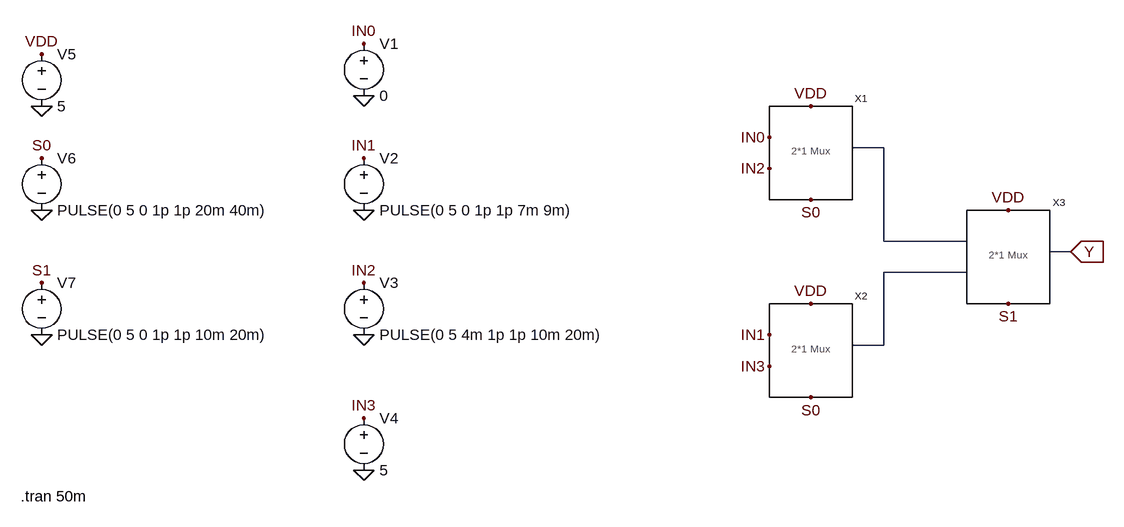
[diagram p0: schematic CASCADED_MUX_TG.asc]
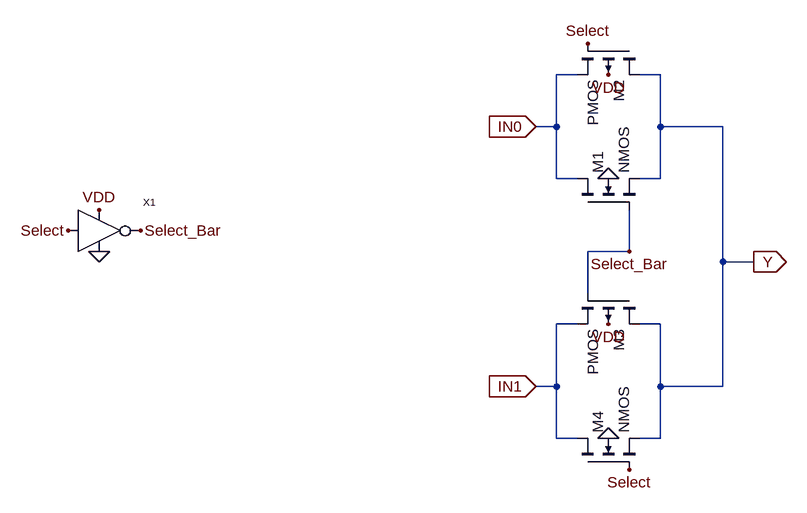
[diagram p1: sub-circuit mux_tg.asc]
CASCADED_MUX_TG.asc, the LTspice schematic file:
Version 4
SHEET 1 1292 680
WIRE 880 -128 832 -128
WIRE 880 16 880 -128
WIRE 1008 16 880 16
WIRE 1168 32 1136 32
WIRE 1008 64 880 64
WIRE 880 176 880 64
WIRE 880 176 832 176
FLAG 80 -288 IN0
FLAG 80 -112 IN1
FLAG 80 80 IN2
FLAG 80 288 IN3
FLAG 80 -208 0
FLAG 80 -32 0
FLAG 80 160 0
FLAG 80 368 0
FLAG -416 160 0
FLAG -416 -32 0
FLAG -416 -192 0
FLAG -416 -272 VDD
FLAG -416 -112 S0
FLAG -416 80 S1
FLAG 768 -192 VDD
FLAG 768 112 VDD
FLAG 1072 -32 VDD
FLAG 704 -144 IN0
FLAG 704 160 IN1
FLAG 704 -96 IN2
FLAG 704 208 IN3
FLAG 768 -48 S0
FLAG 768 256 S0
FLAG 1072 112 S1
FLAG 1168 32 Y
IOPIN 1168 32 In
SYMBOL voltage 80 -304 R0
WINDOW 123 0 0 Left 0
WINDOW 39 0 0 Left 0
SYMATTR InstName V1
SYMATTR Value 0
SYMBOL voltage 80 -128 R0
WINDOW 123 0 0 Left 0
WINDOW 39 0 0 Left 0
SYMATTR InstName V2
SYMATTR Value PULSE(0 5 0 1p 1p 7m 9m)
SYMBOL voltage 80 64 R0
WINDOW 123 0 0 Left 0
WINDOW 39 0 0 Left 0
SYMATTR InstName V3
SYMATTR Value PULSE(0 5 4m 1p 1p 10m 20m)
SYMBOL voltage 80 272 R0
WINDOW 123 0 0 Left 0
WINDOW 39 0 0 Left 0
SYMATTR InstName V4
SYMATTR Value 5
SYMBOL voltage -416 -288 R0
WINDOW 123 0 0 Left 0
WINDOW 39 0 0 Left 0
SYMATTR InstName V5
SYMATTR Value 5
SYMBOL voltage -416 -128 R0
WINDOW 123 0 0 Left 0
WINDOW 39 0 0 Left 0
SYMATTR InstName V6
SYMATTR Value PULSE(0 5 0 1p 1p 20m 40m)
SYMBOL voltage -416 64 R0
WINDOW 123 0 0 Left 0
WINDOW 39 0 0 Left 0
SYMATTR InstName V7
SYMATTR Value PULSE(0 5 0 1p 1p 10m 20m)
SYMBOL MUX_TG 704 -48 R0
SYMATTR InstName X1
SYMBOL MUX_TG 704 256 R0
SYMATTR InstName X2
SYMBOL MUX_TG 1008 112 R0
SYMATTR InstName X3
TEXT -448 408 Left 2 !.tran 50m

mux_tg.asc, the sub-circuit schematic file:
Version 4
SHEET 1 908 680
WIRE 560 -224 528 -224
WIRE 688 -224 656 -224
WIRE 528 -144 528 -224
WIRE 528 -144 496 -144
WIRE 688 -144 688 -224
WIRE 784 -144 688 -144
WIRE 528 -64 528 -144
WIRE 560 -64 528 -64
WIRE 688 -64 688 -144
WIRE 688 -64 656 -64
WIRE 640 48 640 -16
WIRE 640 48 576 48
WIRE 784 64 784 -144
WIRE 832 64 784 64
WIRE 576 112 576 48
WIRE 560 160 528 160
WIRE 688 160 656 160
WIRE 528 256 528 160
WIRE 528 256 496 256
WIRE 688 256 688 160
WIRE 784 256 784 64
WIRE 784 256 688 256
WIRE 528 336 528 256
WIRE 560 336 528 336
WIRE 688 336 688 256
WIRE 688 336 656 336
FLAG 640 48 Select_Bar
FLAG 576 -272 Select
FLAG 640 384 Select
FLAG 608 -64 0
FLAG 608 336 0
FLAG 608 -224 VDD
FLAG 608 160 VDD
FLAG 832 64 Y
IOPIN 832 64 Out
FLAG 496 256 IN1
IOPIN 496 256 In
FLAG 496 -144 IN0
IOPIN 496 -144 In
FLAG -224 16 Select
FLAG -112 16 Select_Bar
FLAG -176 -16 VDD
FLAG -176 48 0
SYMBOL nmos4 560 -16 R270
SYMATTR InstName M1
SYMBOL pmos4 656 -272 R90
SYMATTR InstName M2
SYMBOL pmos4 656 112 R90
SYMATTR InstName M3
SYMBOL nmos4 560 384 R270
SYMATTR InstName M4
SYMBOL CMOS_Inverter -208 48 R0
SYMATTR InstName X1

The netlist it stands for:
* CASCADED_MUX_TG.asc
V1 IN0 0 0
V2 IN1 0 PULSE(0 5 0 1p 1p 7m 9m)
V3 IN2 0 PULSE(0 5 4m 1p 1p 10m 20m)
V4 IN3 0 5
V5 VDD 0 5
V6 S0 0 PULSE(0 5 0 1p 1p 20m 40m)
V7 S1 0 PULSE(0 5 0 1p 1p 10m 20m)
XX1 IN0 IN2 VDD S0 N001 mux_tg
XX2 IN1 IN3 VDD S0 N002 mux_tg
XX3 N001 N002 VDD S1 Y mux_tg

* block symbol definitions
.subckt mux_tg IN0 IN1 VDD Select Y
M1 IN0 Select_Bar Y 0 NMOS
M2 Y Select IN0 VDD PMOS
M3 Y Select_Bar IN1 VDD PMOS
M4 IN1 Select Y 0 NMOS
XX1 VDD 0 Select Select_Bar CMOS_Inverter  ; pins VPOS VNEG VIN VOUT
.ends mux_tg

.model NMOS NMOS
.model PMOS PMOS
.lib standard.mos
.tran 50m
.backanno
.end